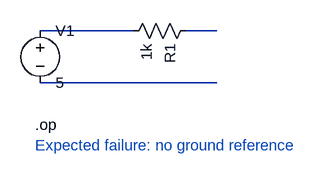
[diagram p0: schematic 09_error_missing_ground.asc]
09_error_missing_ground.asc, the LTspice schematic file:
Version 4
SHEET 1 880 680
WIRE 80 96 224 96
WIRE 304 96 352 96
WIRE 80 176 352 176
SYMBOL voltage 80 80 R0
SYMATTR InstName V1
SYMATTR Value 5
SYMBOL res 320 80 R90
SYMATTR InstName R1
SYMATTR Value 1k
TEXT 72 240 Left 2 !.op
TEXT 72 272 Left 2 ;Expected failure: no ground reference

The netlist it stands for:
* 09_error_missing_ground.asc
V1 N001 N003 5
R1 N002 N001 1k
.op
* Expected failure: no ground reference
.backanno
.end